# EAGLE design xmas_lights_rev2 (EAGLE 7.1.0)
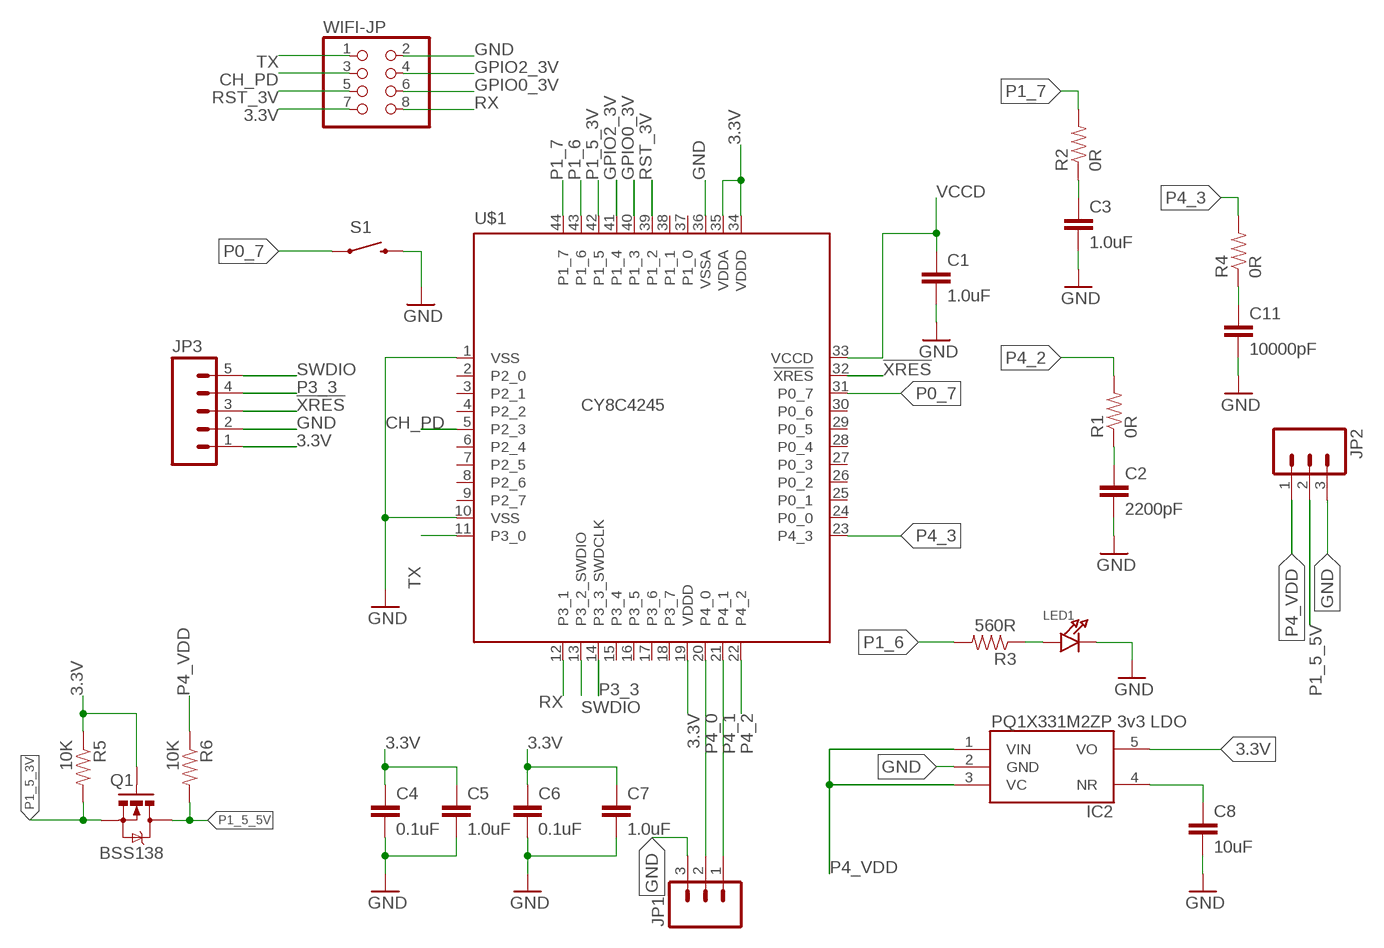
[diagram p0: schematic, sheet 1]

## Parts
C1  1.0uF  CAP0805  [0805]
C2  2200pF  CAP0805  [0805]
C3  1.0uF  CAP0805  [0805]
C4  0.1uF  CAP0805  [0805]
C5  1.0uF  CAP0805  [0805]
C6  0.1uF  CAP0805  [0805]
C7  1.0uF  CAP0805  [0805]
C8  10uF  CAP0805  [0805]
C11  10000pF  CAP0805  [0805]
IC2  PQ1X331M2ZP-3V3-LDO-SOT-23-5  [SOT-23-5]
JP1  M031X03_NO_SILK  [1X03_NO_SILK]
JP2  M031X03_NO_SILK  [1X03_NO_SILK]
JP3  M05PTH  [1X05]
LED1  LED0805  [CHIPLED_0805]
Q1  BSS138  MOSFET-NCHANNELSMD  [SOT23-3]
R1  0R  RESISTOR0805-RES  [0805]
R2  0R  RESISTOR0805-RES  [0805]
R3  560R  RESISTOR0805-RES  [0805]
R4  0R  RESISTOR0805-RES  [0805]
R5  10K  RESISTOR0805-RES  [0805]
R6  10K  RESISTOR0805-RES  [0805]
S1  SPARKFUN_SWITCH-MOMENTARY-2SMD  [SPARKFUN_TACTILE_SWITCH_SMD]
U$1  CY8C4245  CY8C4245AXI-483  [TQFP44]
WIFI-JP  PINHD-2X4  [2X04]

## Nets
3.3V: C4.1 C5.1 C6.1 C7.1 IC2.5(VO) JP3.1 Q1.1(G) R5.1 U$1.19(VDDD) U$1.34(VDDD) U$1.35(VDDA) WIFI-JP.7
!XRES: JP3.3 U$1.32(!XRES)
CH_PD: U$1.5(P2_3) WIFI-JP.3
GND: C1.2 C2.2 C3.2 C4.2 C5.2 C6.2 C7.2 C8.2 C11.2 IC2.2(GND) JP1.3 JP2.3 JP3.2 LED1.C S1.3 U$1.1(VSS) U$1.10(VSS) U$1.36(VSSA) WIFI-JP.2
GPIO0_3V: U$1.40(P1_3) WIFI-JP.6
GPIO2_3V: U$1.41(P1_4) WIFI-JP.4
N$4: C2.1 R1.1
N$5: C3.1 R2.1
N$8: C11.1 R4.1
N$9: LED1.A R3.1
N$14: C8.1 IC2.4(NR)
P0_7: S1.1 U$1.31(P0_7)
P1_5_3V: Q1.2(S) R5.2 U$1.42(P1_5)
P1_5_5V: JP2.2 Q1.3(D) R6.2
P1_6: R3.2 U$1.43(P1_6)
P1_7: R2.2 U$1.44(P1_7)
P3_3: JP3.4 U$1.14(P3_3_SWDCLK)
P4_0: JP1.2 U$1.20(P4_0)
P4_1: JP1.1 U$1.21(P4_1)
P4_2: R1.2 U$1.22(P4_2)
P4_3: R4.2 U$1.23(P4_3)
P4_VDD: IC2.1(VIN) IC2.3(VC) JP2.1 R6.1
RST_3V: U$1.39(P1_2) WIFI-JP.5
RX: U$1.12(P3_1) WIFI-JP.8
SWDIO: JP3.5 U$1.13(P3_2_SWDIO)
TX: U$1.11(P3_0) WIFI-JP.1
VCCD: C1.1 U$1.33(VCCD)
Unconnected: U$1.2(P2_0) U$1.3(P2_1) U$1.4(P2_2) U$1.6(P2_4) U$1.7(P2_5) U$1.8(P2_6) U$1.9(P2_7) U$1.15(P3_4) U$1.16(P3_5) U$1.17(P3_6) U$1.18(P3_7) U$1.24(P0_0) U$1.25(P0_1) U$1.26(P0_2) U$1.27(P0_3) U$1.28(P0_4) U$1.29(P0_5) U$1.30(P0_6) U$1.37(P1_0) U$1.38(P1_1)

## Library data of the parts
C1-C8 C11 = SparkFun-Capacitors:CAP: Capacitor Standard 0603 ceramic capacitor, and 0.1" leaded capacitor.
IC2 = STM32-PROX:PQ1X331M2ZP-3V3-LDO-SOT-23-5
JP1 JP2 = SparkFun-Connectors:M03: Header 3 Standard 3-pin 0.1" header. Use with straight break away headers (SKU : PRT-00116), right angle break away headers (PRT-00553), swiss pins (PRT-00743), machine pins (PRT-00117), and female headers (PRT-00115). Molex polarized connector foot print use with SKU : PRT-08232 with associated crimp pins and housings.
JP3 = SparkFun-Connectors:M05: Header 5 Standard 5-pin 0.1" header. Use with straight break away headers (SKU : PRT-00116), right angle break away headers (PRT-00553), swiss pins (PRT-00743), machine pins (PRT-00117), and female headers (PRT-00115). Molex polarized connector foot print use with SKU : PRT-08230 with associated crimp pins and housings.
LED1 = microbuilder:LED: LED 0603 - 0603 Surface Mount Package Green LED - Low Power (3.9mcd, 2ma, 1.7Vf) Orange LED - Low Power (9.8mcd, 2ma, 1.8Vf) Red LED - Low Power (5mcd, 2ma, 1.8Vf) Yellow LED - Low Power (7mcd, 2ma, 1.8Vf) 0805 - 0805 Surface Mount Package 20mA: Red LED (104mcd, 20mA, Diffused) - LS R976 [Digikey: 475-1278-6-ND] Red LED (12mcd, 20mA, 2.0Vf, Clear) - APT2012EC [Digikey: 754-1128-1-ND] Green LED (15mcd, 20mA, 2.2Vf, Clear) - APT2012GC [Digikey: 754-1131-1-ND] Orange LED (160mcd, 20mA, 2.1Vf, Clear) - APT2012SECK [Digikey: 754-1130-1-ND] 2mA: Red LED (8.8mcd, 2mA, 1.8Vf, Clear) - Low Power [Digikey: 475-2510-1-ND] Green LED (5mcd, 2mA, 1.8Vf, Clear) - Low Power [Digikey: 475-2730-1-ND] Yellow LED (11.3mcd, 2mA, 1.8Vf, Clear) - Low Power [Digikey: 475-2555-1-ND] 1206 - 1206 Surface Mount Package Green LED (26mcd, 20mA, Diffused) - LG N971 [Digikey: 475-1407-6-ND] Red LED (15mcd, 20mA, Diffused) - LH N974 [Digikey: 475-1416-6-ND]
Q1 = SparkFun:MOSFET-NCHANNEL
R1-R4 = SparkFun-Resistors:RESISTOR: Resistor Basic schematic elements and footprints for 0603, 1206, and PTH resistors.
R5 R6 = SparkFun:RESISTOR: Resistor Basic schematic elements and footprints for 0603, 1206, and PTH resistors.
S1 = Nullspace:SPARKFUN_SWITCH-MOMENTARY-2
U$1 = cypress:CY8C4245AXI-483
WIFI-JP = pinhead:PINHD-2X4: PIN HEADER

## Net classes
0 default: width 0.203 mm

## Board
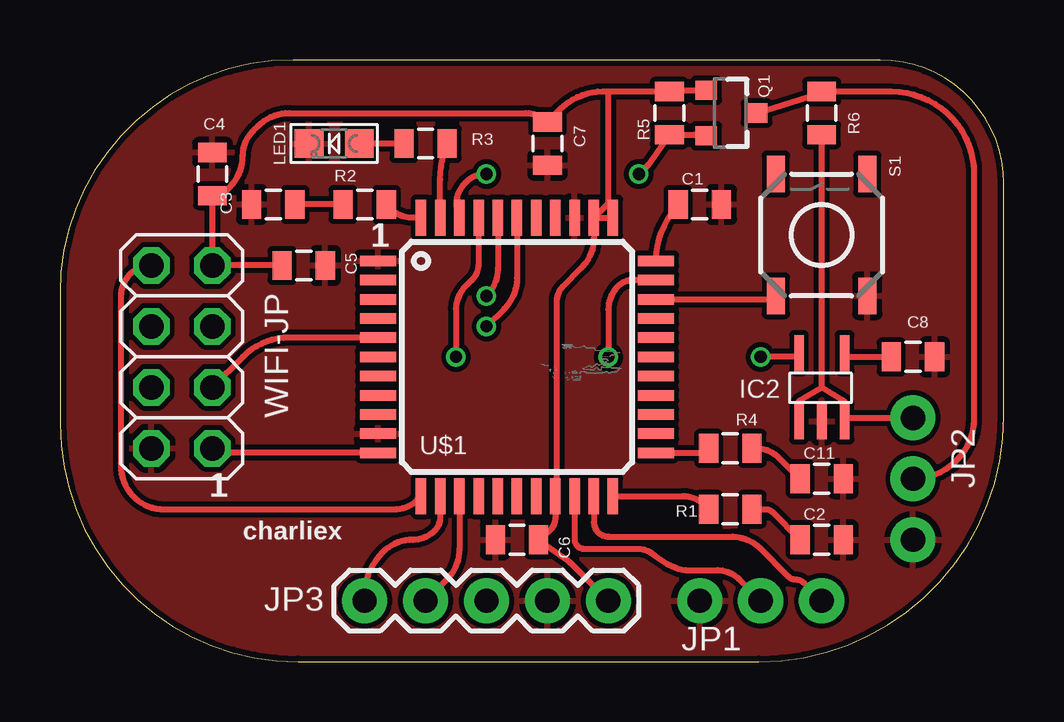
[diagram p1: board, top side]
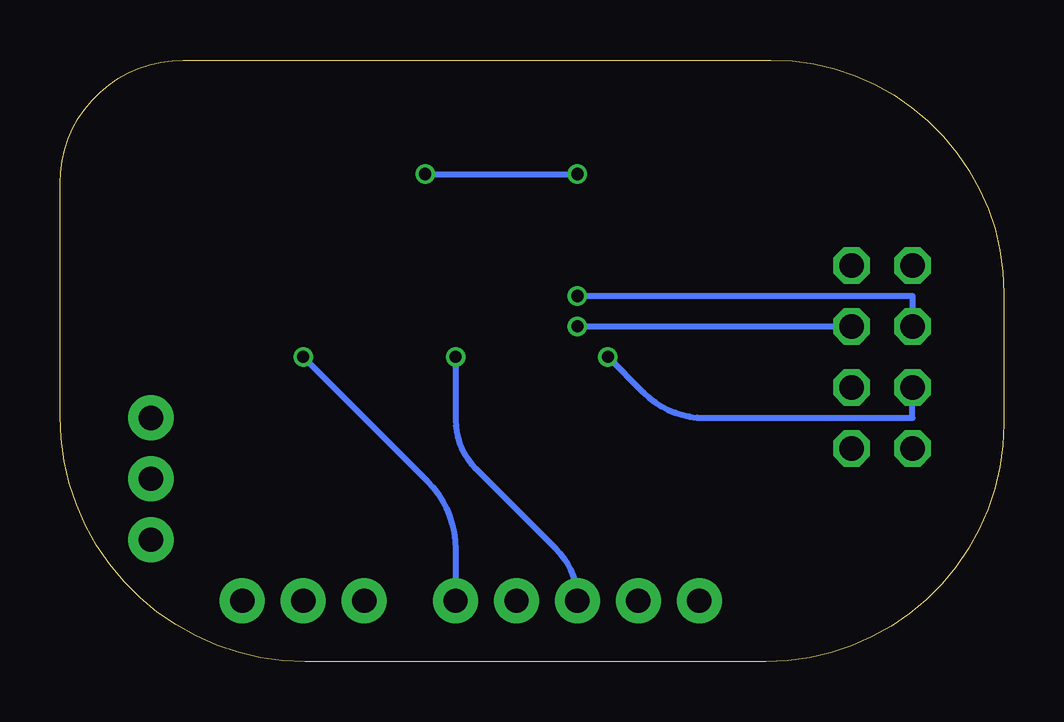
[diagram p2: board, bottom side, seen from below]

Size 39.35 x 25.07 mm. Coordinates in mm from the lower left corner, seen from the top.
Outline: 0,15.36 0,9.92 arc90 9.92,0 29.13,0 arc90 39.35,10.22 39.35,19.93 arc90 34.2,25.07 9.71,25.07 arc90 0,15.36
Copper layers (1*16): Top 0.035mm / dielectric 1.5mm / Bottom 0.035mm
Design rules "ITEADstudio_DRC": minimum track width 6mil, minimum drill 12mil, track to track 6mil, track to pad 6mil, pad to pad 6mil, via to via 6mil, smd to smd 0mil, copper to edge 10mil, drill to drill 10mil, minimum pad ring 10mil, minimum via ring 6mil, stop-mask expansion 2mil, vias tented up to drill 100mil, thermal gap 10mil

### Footprints (pad centres in the part's own frame; a part is rotated, then mirrored left to right if it is on the bottom)
0805 = smd 0.8 x 1.2: 1 -0.9,0; 2 0.9,0
SOT-23-5 = smd 0.4 x 1.5: 1 -0.94,-1.422; 2 0.01,-1.422; 3 0.96,-1.422; 4 0.96,1.428; 5 -0.94,1.428
1X03_NO_SILK = drill 1.016 pad 1.88: 1 0,0; 2 2.54,0; 3 5.08,0
1X05 = drill 1.016 pad 1.88: 1 0,0; 2 2.54,0; 3 5.08,0; 4 7.62,0; 5 10.16,0
CHIPLED_0805 = smd 1.2 x 1.2: A 0,-1.05; C 0,1.05
SOT23-3 = smd 0.8 x 0.9: 1 -0.95,-1; 2 0.95,-1; 3 0,1.1
SPARKFUN_TACTILE_SWITCH_SMD = smd 1.524 x 0.762: 1 -2.54,1.905; 2 2.54,1.905; 3 -2.54,-1.905; 4 2.54,-1.905
TQFP44 = smd 1.5 x 0.44: 1 -5.8,4; 2 -5.8,3.2; 3 -5.8,2.4; 4 -5.8,1.6; 5 -5.8,0.8; 6 -5.8,0; 7 -5.8,-0.8; 8 -5.8,-1.6; 9 -5.8,-2.4; 10 -5.8,-3.2; 11 -5.8,-4; 23 5.8,-4; 24 5.8,-3.2; 25 5.8,-2.4; 26 5.8,-1.6; 27 5.8,-0.8; 28 5.8,0; 29 5.8,0.8; 30 5.8,1.6; 31 5.8,2.4; 32 5.8,3.2; 33 5.8,4 | smd 0.44 x 1.5: 12 -4,-5.8; 13 -3.2,-5.8; 14 -2.4,-5.8; 15 -1.6,-5.8; 16 -0.8,-5.8; 17 0,-5.8; 18 0.8,-5.8; 19 1.6,-5.8; 20 2.4,-5.8; 21 3.2,-5.8; 22 4,-5.8; 34 4,5.8; 35 3.2,5.8; 36 2.4,5.8; 37 1.6,5.8; 38 0.8,5.8; 39 0,5.8; 40 -0.8,5.8; 41 -1.6,5.8; 42 -2.4,5.8; 43 -3.2,5.8; 44 -4,5.8
2X04 = drill 1.016 octagon: 1 -3.81,-1.27; 2 -3.81,1.27; 3 -1.27,-1.27; 4 -1.27,1.27; 5 1.27,-1.27; 6 1.27,1.27; 7 3.81,-1.27; 8 3.81,1.27

### Placement (x,y rotation side)
C1  26.67,19.05 0 top
C2  31.75,5.08 0 top
C3  8.89,19.05 180 top
C4  6.35,20.32 90 top
C5  10.16,16.51 0 top
C6  19.05,5.08 180 top
C7  20.32,21.59 270 top
C8  35.56,12.7 0 top
C11  31.75,7.62 0 top
IC2  31.75,11.43 0 top
JP1  31.75,2.54 180 top
JP2  35.56,10.16 270 top
JP3  22.86,2.54 180 top
LED1  11.43,21.59 90 top
Q1  27.94,22.86 270 top
R1  27.94,6.35 180 top
R2  12.7,19.05 0 top
R3  15.24,21.59 0 top
R4  27.94,8.89 180 top
R5  25.4,22.86 270 top
R6  31.75,22.86 90 top
S1  31.75,17.78 90 top
U$1  19.05,12.7 0 top
WIFI-JP  5.08,12.7 90 top

### Tracks (layer width: path | path; a pad name or v marks a point on that pad's centre or on a via)
3.3V  (via drill 0.51)
  Top 0.254: U$1.19 20.65,6.22 | 20.65,6.22 20.65,6.02 arc-51 20.36,5.42 C6.1 21.15,4.23 arc-10 21.28,4.12 JP3.1 | U$1.35 U$1.34 | U$1.35 22.25,17.66 arc-45 21.73,16.39 20.96,15.63 arc45 20.7,14.99 20.7,6.27 20.65,6.22 | IC2.5 30.65,12.7 v29.21,12.7 | 22.86,23.76 22.63,23.76 arc45 20.85,23.02 C7.1 arc45 19.43,22.86 9.57,22.86 arc45 8.25,22.31 8.06,22.12 arc45 7.62,21.06 arc-45 7.09,19.79 6.72,19.42 C4.1 WIFI-JP.7 C5.1 | 22.86,23.76 R5.1 25.45,23.81 Q1.1 | U$1.35 22.86,19.11 22.86,23.76
  Bottom 0.254: v29.21,12.7 24.04,7.53 arc45 22.86,4.69 JP3.1
!XRES  (via drill 0.51)
  Top 0.254: U$1.32 23.89,15.9 arc45 23.26,15.64 arc45 22.86,14.68 v22.86,12.7
  Bottom 0.254: v22.86,12.7 22.86,10.07 arc-45 22.03,8.06 18.68,4.71 arc45 JP3.3
CH_PD
  Top 0.254: U$1.5 9.54,13.5 arc45 7.63,12.71 WIFI-JP.3
GND
  pour Top (isolate 0.203): 9.92,0 29.45,0 arc90 39.37,9.92 39.37,20.01 arc90 33.98,25.4 9.92,25.4 arc90 0,15.48 0,9.92 arc90
GPIO0_3V  (via drill 0.51)
  Top 0.254: U$1.40 18.25,16.38 arc-45 v17.78,15.24
  Bottom 0.254: v17.78,15.24 3.81,15.24 WIFI-JP.6
GPIO2_3V  (via drill 0.51)
  Top 0.254: U$1.41 17.45,16.59 arc-45 17.16,15.89 16.88,15.61 arc45 16.51,14.71 v16.51,12.7
  Bottom 0.254: v16.51,12.7 15.02,11.21 arc-45 12.48,10.16 3.81,10.16 WIFI-JP.4
N$4
  Top 0.254: R1.1 29.43,6.35 arc-45 29.69,6.24 C2.1
N$5
  Top 0.254: R2.1 C3.1
N$8
  Top 0.254: R4.1 29.03,8.89 arc-45 29.97,8.5 C11.1
N$9
  Top 0.254: R3.1 LED1.A
N$14
  Top 0.254: IC2.4 32.87,12.7 C8.1
P0_7
  Top 0.254: U$1.31 29.7,15.1 S1.1
P1_5_3V  (via drill 0.51)
  Top 0.254: Q1.2 26.45,21.96 R5.2 24.5,20.69 v24.13,20.32 | v17.78,20.32 arc116 U$1.42
  Bottom 0.254: v24.13,20.32 v17.78,20.32
P1_5_5V
  Top 0.254: Q1.3 31.95,23.76 | R6.2 31.95,23.76 | 31.95,23.76 34.66,23.76 arc-90 38.1,20.32 38.1,10.16 arc-90 JP2.2
P1_6
  Top 0.254: U$1.43 15.85,20.09 arc-16 16,21.1 R3.2
P1_7
  Top 0.254: U$1.44 14.66,18.5 arc-45 13.79,18.86 R2.2
P3_3
  Top 0.254: U$1.14 16.65,4.7 arc-45 16.12,3.42 JP3.4
P4_0
  Top 0.254: U$1.20 21.45,5.11 arc90 21.86,4.7 24.11,4.7 arc-45 24.79,4.42 25.33,4.05 25.79,3.87 26.07,3.81 27.41,3.81 arc-45 28.31,3.44 JP1.2
P4_1
  Top 0.254: U$1.21 22.25,5.83 arc90 22.87,5.21 28.04,5.21 arc-45 29.17,4.74 30.37,3.54 arc45 30.64,3.43 arc-45 31.02,3.27 JP1.1
P4_2
  Top 0.254: U$1.22 25.98,6.9 arc-45 26.85,6.54 R1.2
P4_3
  Top 0.254: U$1.23 26.85,8.7 R4.2
P4_VDD
  Top 0.254: IC2.1 30.81,10.87 31.75,11.43 | 31.75,11.43 32.71,10.85 IC2.3 32.86,10.16 JP2.1 | 31.75,11.43 31.75,21.59 31.38,21.96 R6.1
RST_3V  (via drill 0.51)
  Top 0.254: U$1.39 19.05,15.98 arc-45 18.52,14.71 v17.78,13.97
  Bottom 0.254: v17.78,13.97 WIFI-JP.5
RX
  Top 0.254: WIFI-JP.8 arc90 2.54,15.24 2.54,8.15 arc90 4.34,6.35 13.93,6.35 arc45 14.9,6.75 U$1.12
SWDIO
  Top 0.254: U$1.13 15.85,6.03 arc-45 15.61,5.45 arc-45 14.71,5.08 arc45 13.44,4.55 arc45 12.7,2.76 JP3.5
TX
  Top 0.254: U$1.11 6.54,8.7 WIFI-JP.1
VCCD
  Top 0.254: U$1.33 arc-36 25.48,18.66 C1.1

### Text on the board
tNames: 1 | 1 | charliex